# Altium schematic sheet Buck Converter.SchDoc
size A; SheetNumber: 8; SheetTotal: 9
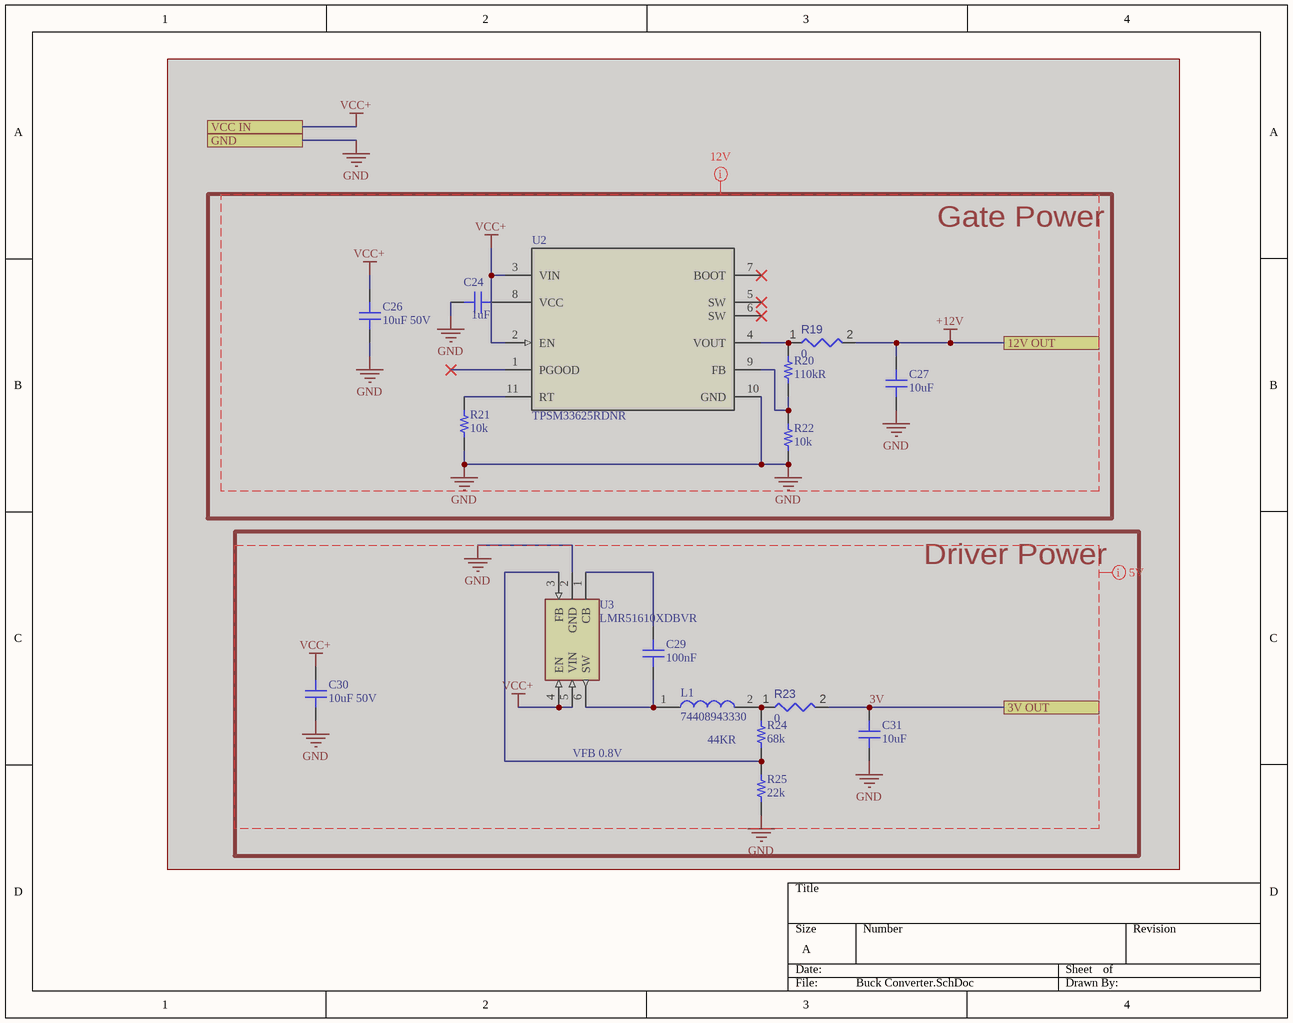
[diagram p0: Buck Converter.SchDoc]

## Parts
C24  1uF  [CAP 0603_1608]  (masked out: inside a compile mask, not in the netlist)
C26  10uF 50V  [CAP 1210_3225 - 1MM]  (masked out: inside a compile mask, not in the netlist)
C27  10uF  [CAP 1210_3225 - 1MM]  (masked out: inside a compile mask, not in the netlist)
C29  100nF  [CAP 0402_1005]  (masked out: inside a compile mask, not in the netlist)
C30  10uF 50V  [CAP 1210_3225 - 1MM]  (masked out: inside a compile mask, not in the netlist)
C31  10uF  [CAP 1210_3225 - 1MM]  (masked out: inside a compile mask, not in the netlist)
L1  74408943330  [WE-SPC_48XX78]  (masked out: inside a compile mask, not in the netlist)
R19  value 0  [RESC0402(1005)_L]  (hidden comment: Jumper 0402)  (masked out: inside a compile mask, not in the netlist)
R20  110kR  [RES 0402_1005]  (masked out: inside a compile mask, not in the netlist)
R21  10k  [RES 0402_1005]  (masked out: inside a compile mask, not in the netlist)
R22  10k  [RES 0402_1005]  (masked out: inside a compile mask, not in the netlist)
R23  value 0  [RESC0402(1005)_L]  (hidden comment: Jumper 0402)  (masked out: inside a compile mask, not in the netlist)
R24  68k  [RES 0402_1005]  (masked out: inside a compile mask, not in the netlist)
R25  22k  [RES 0402_1005]  (masked out: inside a compile mask, not in the netlist)
U2  TPSM33625RDNR  [RDN0011A-MFG]  (masked out: inside a compile mask, not in the netlist)
U3  LMR51610XDBVR  [SOT95P280X145-6N]  (masked out: inside a compile mask, not in the netlist)

## Blocks framed on the sheet
Gate Power: C24 C26 C27 R19-R22 U2
Driver Power: C29-C31 L1 R23-R25 U3

## Ports
3V OUT, 12V OUT, GND, VCC IN

## Layout directives
CompClassName: 12v: +12V, GND, VCC+
CompClassName: 5v: 3V, GND, VCC+

## Notes on the sheet
- VFB 0.8V
- 44KR

## Library data of the parts
C24 = ZRB186R60J226ME11L: CAP CER 22UF 6.3V X5R 0603; manufacturer: Murata Electronics; Capacitance: 1 µF; Tolerance: ±20%; value: 22 µF; Part Number: ZRB186R60J226ME11L; Applications: Acoustic Noise Reduction; componentlink1description: Datasheet; componentlink1url: https://psearch.en.murata.com/capacitor/product/ZRB186R60J226ME11%23.pdf; componentlink2description: DigiKey Link; componentlink2url: https://www.digikey.com/en/products/detail/murata-electronics/ZRB186R60J226ME11L/5877417; Device Package: 0603 (1608 Metric); Features: Interposer Termination; lastupdated: 2/9/2024 8:10:30 PM; Lifecycle Status: Active; Minimum Order: 1; Mounting Type: Surface Mount, MLCC; Operating Temperature: -55°C ~ 85°C; Package / Case: 0603 (1608 Metric); packaging: TapeAndReel; partid: 2449; Part Status: Active; price: 0.05; series: ZRB; Size / Dimension: 0.063" L x 0.031" W (1.60mm x 0.80mm); Supplier 1: DigiKey; Supplier Part Number 1: 490-13254-1-ND; Temperature Coefficient: X5R; Thickness (Max): 0.031" (0.80mm); Voltage - Rated: 6.3V
C26 C27 C30 C31 = MSAST32NSB5106MTNA01: CAP CER 10UF 25V X5R 1210; manufacturer: Taiyo Yuden; Value: 10 µF; Tolerance: ±20%; Part Number: MSAST32NSB5106MTNA01; Applications: SMPS Filtering; Capacitance: 10 µF; componentlink1description: Datasheet; componentlink1url: https://mm.digikey.com/Volume0/opasdata/d220001/medias/docus/5731/MSR01_e.pdf; componentlink2description: DigiKey Link; componentlink2url: https://www.digikey.com/en/products/detail/taiyo-yuden/MSAST32NSB5106MTNA01/16661899; Device Package: 1210 (3225 Metric); lastupdated: 6/4/2024 7:20:40 PM; Lifecycle Status: Active; Minimum Order: 1; Mounting Type: Surface Mount, MLCC; Operating Temperature: -55°C ~ 85°C; Package / Case: 1210 (3225 Metric); packaging: TapeAndReel; partid: 58126; price: 0.08; series: MSAS; Size / Dimension: 0.126" L x 0.098" W (3.20mm x 2.50mm); Supplier 1: DigiKey; Supplier Part Number 1: 587-MSAST32NSB5106MTNA01CT-ND; Temperature Coefficient: X5R; Thickness (Max): 0.083" (2.10mm); Voltage - Rated: 25V
C29 = ZRB157R61E225KE11D: CAP CER 2.2UF 25V X5R 0402; manufacturer: Murata Electronics; Capacitance: 2.2 µF; Tolerance: ±10%; value: 2.2 µF; Part Number: ZRB157R61E225KE11D; Applications: Acoustic Noise Reduction; componentlink1description: Datasheet; componentlink1url: https://search.murata.co.jp/Ceramy/image/img/A01X/G101/ENG/ZRB157R61E225KE11-01.pdf; componentlink2description: DigiKey Link; componentlink2url: https://www.digikey.com/en/products/detail/murata-electronics/ZRB157R61E225KE11D/5321074; Device Package: 0402 (1005 Metric); Features: Interposer Termination; lastupdated: 2/9/2024 8:04:27 PM; Lifecycle Status: Active; Minimum Order: 1; Mounting Type: Surface Mount, MLCC; Operating Temperature: -55°C ~ 85°C; Package / Case: 0402 (1005 Metric); packaging: TapeAndReel; partid: 8590; Part Status: Active; price: 0.04; series: ZRB; Size / Dimension: 0.039" L x 0.020" W (1.00mm x 0.50mm); Supplier 1: DigiKey; Supplier Part Number 1: 490-10982-1-ND; Temperature Coefficient: X5R; Thickness (Max): 0.033" (0.85mm); Voltage - Rated: 25V
L1 = 74408943330: Inductor; Manufacturer_Name: Wurth Elektronik; Manufacturer_Part_Number: 74408943330; Mouser Part Number: 710-74408943330; Mouser Price/Stock: https://www.mouser.co.uk/ProductDetail/Wurth-Elektronik/74408943330?qs=iRra8H4EogoP8BtLUesdVg%3D%3D
R19 R23 = CMP-009-00148-2: Max Operating Temperature: 155°C; Pins: 2; Case/Package: 0402; Min Operating Temperature: -55°C
R20-R22 R24 R25 = RP73PF1E249KBTD: RES 249K OHM 0.1% 1/10W 0402; Manufacturer: TE Connectivity Passive Product; Value: 249 kOhms; Power (Watts): 0.1W, 1/10W; Temperature Coefficient: ±25ppm/°C; Part Number: RP73PF1E249KBTD; ComponentLink1Description: Datasheet; ComponentLink1URL: https://www.te.com/commerce/DocumentDelivery/DDEController?Action=srchrtrv&DocNm=1773272&DocType=DS&DocLang=English; ComponentLink2Description: DigiKey Link; ComponentLink2URL: https://www.digikey.com/en/products/detail/te-connectivity-passive-product/RP73PF1E249KBTD/8261091; Composition: Thin Film; Device Package: 0402 (1005 Metric); Height - Seated (Max): 0.014" (0.35mm); LastUpdated: 2/9/2024 8:30:24 PM; Lifecycle Status: Active; Minimum Order: 1; Number of Terminations: 2; Operating Temperature: -55°C ~ 155°C; Package / Case: 0402 (1005 Metric); Packaging: TapeAndReel; PartId: 2418; Part Status: Active; Price: 0.07; Resistance: 249 kOhms; Series: RP73, Holsworthy; Size / Dimension: 0.039" L x 0.020" W (1.00mm x 0.50mm); Supplier 1: DigiKey; Supplier Part Number 1: A127549CT-ND; Supplier Device Package: 0402; Tolerance: ±0.1%
U2 = TPSM33625RDNR: No Description Available; Mfr_Name: Texas Instruments; TYPE: TYPE; RefDes: RefDes
U3 = LMR51610XDBVR: SIMPLE SWITCHER&reg; 4.5-V to 65-V, 1-A synchronous buck converter with 25-&micro;A&nbsp;IQ; MF: Texas Instruments; SnapEDA_Link: https://www.snapeda.com/parts/LMR51610XDBVR/Texas+Instruments/view-part/?ref=snap; Package: None; Value: *; MP: LMR51610XDBVR; Check_prices: https://www.snapeda.com/parts/LMR51610XDBVR/Texas+Instruments/view-part/?ref=eda